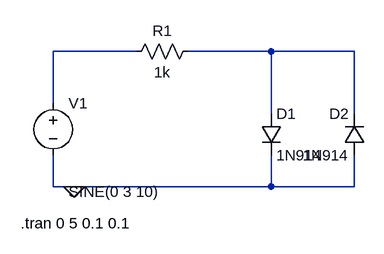
[diagram p0: schematic Draft3.asc]
Draft3.asc, the LTspice schematic file:
Version 4
SHEET 1 880 680
WIRE 240 112 112 112
WIRE 448 112 320 112
WIRE 576 112 448 112
WIRE 112 192 112 112
WIRE 448 208 448 112
WIRE 576 208 576 112
WIRE 112 320 112 272
WIRE 144 320 112 320
WIRE 448 320 448 272
WIRE 448 320 144 320
WIRE 576 320 576 272
WIRE 576 320 448 320
FLAG 144 320 0
SYMBOL voltage 112 176 R0
WINDOW 3 24 152 Left 2
WINDOW 123 24 124 Left 2
WINDOW 39 0 0 Left 0
SYMATTR InstName V1
SYMATTR Value SINE(0 3 10)
SYMBOL res 336 96 R90
WINDOW 0 0 56 VBottom 2
WINDOW 3 32 56 VTop 2
SYMATTR InstName R1
SYMATTR Value 1k
SYMBOL diode 432 208 R0
SYMATTR InstName D1
SYMATTR Value 1N914
SYMBOL diode 592 272 R180
WINDOW 0 24 64 Left 2
WINDOW 3 24 0 Left 2
SYMATTR InstName D2
SYMATTR Value 1N914
TEXT 62 376 Left 2 !.tran 0 5 0.1 0.1

The netlist it stands for:
* Draft3.asc
V1 N001 0 SINE(0 3 10)
R1 N002 N001 1k
D1 N002 0 1N914
D2 0 N002 1N914
.model D D
.lib standard.dio
.tran 0 5 0.1 0.1
.backanno
.end